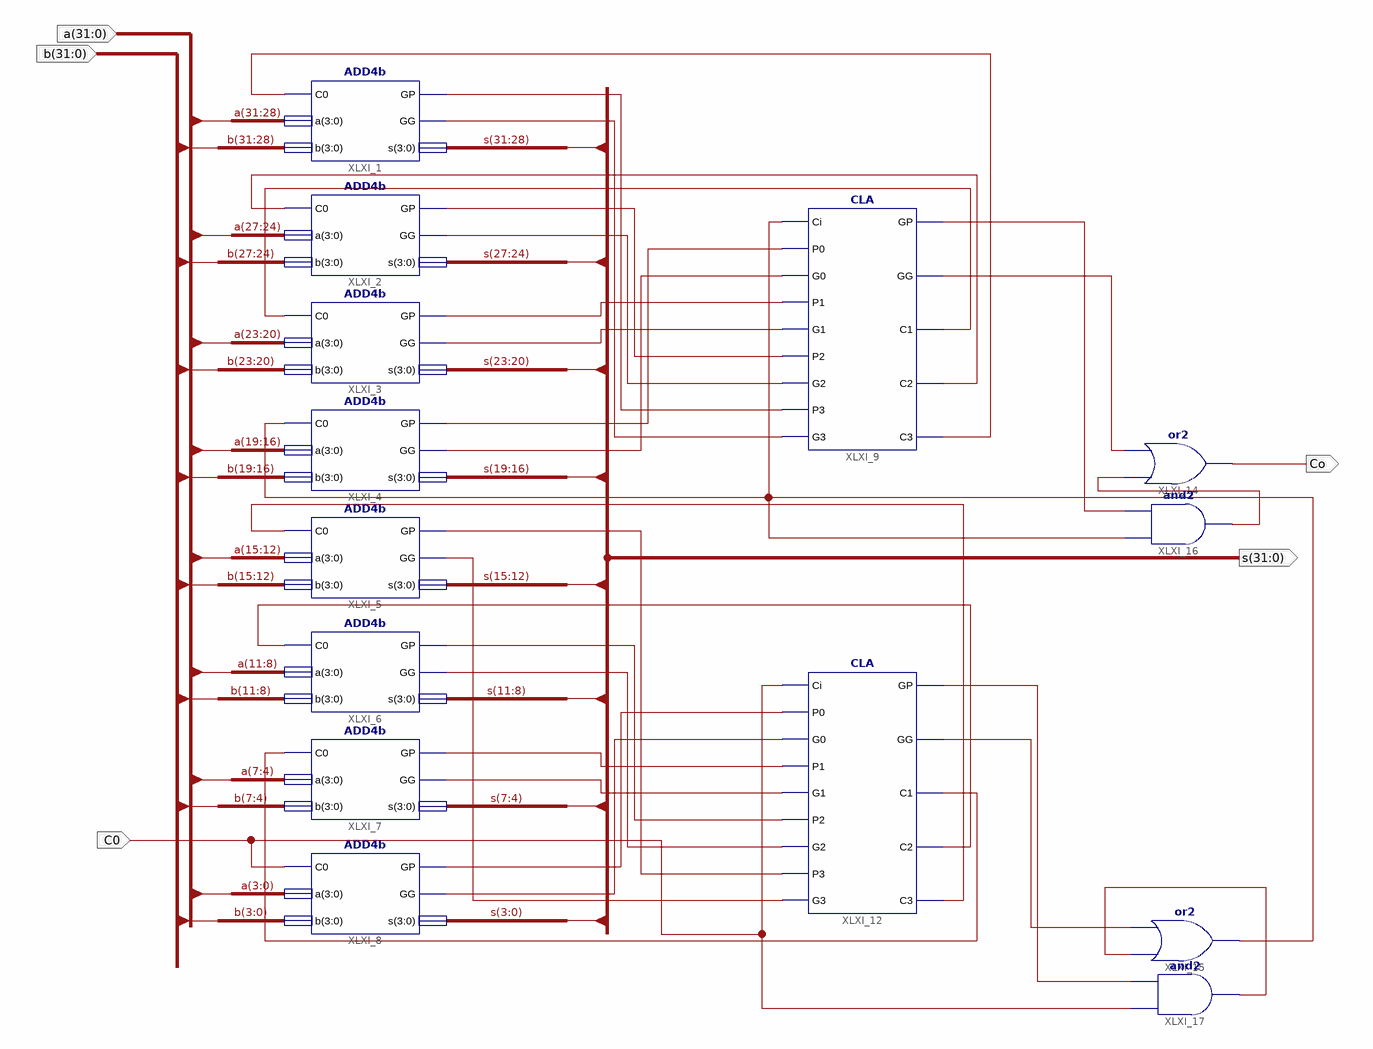
[diagram p0: schematic sheet 1]
// Xilinx ISE schematic ADC32.sch (kintex7) as structural Verilog: 14 symbols, 5 ports
module ADC32 (
  input  [31:0] a,
  input  [31:0] b,
  input  C0,
  output [31:0] s,
  output Co
);

  wire XLXN_1, XLXN_2, XLXN_23, XLXN_50, XLXN_51, XLXN_52, XLXN_53, XLXN_54, XLXN_55, XLXN_56, XLXN_57,
       XLXN_58, XLXN_59, XLXN_60, XLXN_61, XLXN_62, XLXN_63, XLXN_64, XLXN_65, XLXN_67, XLXN_68, XLXN_73,
       XLXN_74, XLXN_81, XLXN_82, XLXN_83, XLXN_85, XLXN_86, XLXN_87;

  ADD4b XLXI_1 (.C0(XLXN_1), .a(a[31:28]), .b(b[31:28]), .GP(XLXN_51), .GG(XLXN_50), .s(s[31:28]));
  ADD4b XLXI_2 (.C0(XLXN_2), .a(a[27:24]), .b(b[27:24]), .GP(XLXN_53), .GG(XLXN_52), .s(s[27:24]));
  ADD4b XLXI_3 (.C0(XLXN_23), .a(a[23:20]), .b(b[23:20]), .GP(XLXN_55), .GG(XLXN_54), .s(s[23:20]));
  ADD4b XLXI_4 (.C0(XLXN_67), .a(a[19:16]), .b(b[19:16]), .GP(XLXN_57), .GG(XLXN_56), .s(s[19:16]));
  ADD4b XLXI_5 (.C0(XLXN_87), .a(a[15:12]), .b(b[15:12]), .GP(XLXN_65), .GG(XLXN_64), .s(s[15:12]));
  ADD4b XLXI_6 (.C0(XLXN_86), .a(a[11:8]), .b(b[11:8]), .GP(XLXN_63), .GG(XLXN_62), .s(s[11:8]));
  ADD4b XLXI_7 (.C0(XLXN_85), .a(a[7:4]), .b(b[7:4]), .GP(XLXN_61), .GG(XLXN_60), .s(s[7:4]));
  ADD4b XLXI_8 (.C0(C0), .a(a[3:0]), .b(b[3:0]), .GP(XLXN_59), .GG(XLXN_58), .s(s[3:0]));
  CLA XLXI_9 (
    .Ci(XLXN_67), .P0(XLXN_57), .G0(XLXN_56), .P1(XLXN_55), .G1(XLXN_54), .P2(XLXN_53), .G2(XLXN_52),
    .P3(XLXN_51), .G3(XLXN_50), .GP(XLXN_68), .GG(XLXN_74), .C1(XLXN_23), .C2(XLXN_2), .C3(XLXN_1));
  CLA XLXI_12 (
    .Ci(C0), .P0(XLXN_59), .G0(XLXN_58), .P1(XLXN_61), .G1(XLXN_60), .P2(XLXN_63), .G2(XLXN_62),
    .P3(XLXN_65), .G3(XLXN_64), .GP(XLXN_81), .GG(XLXN_82), .C1(XLXN_85), .C2(XLXN_86), .C3(XLXN_87));
  or XLXI_14 (Co, XLXN_73, XLXN_74);
  or XLXI_15 (XLXN_67, XLXN_83, XLXN_82);
  and XLXI_16 (XLXN_73, XLXN_67, XLXN_68);
  and XLXI_17 (XLXN_83, C0, XLXN_81);
endmodule
